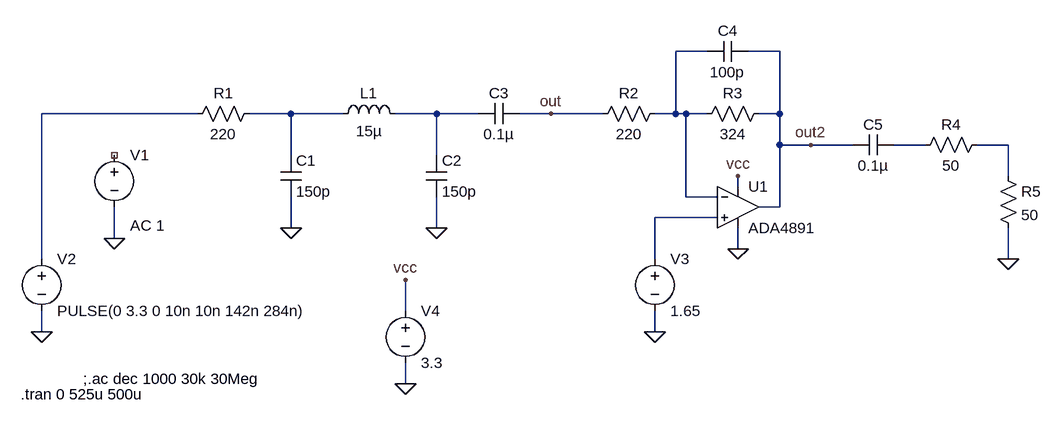
[diagram p0: schematic Baseband_Filter.asc]
Baseband_Filter.asc, the LTspice schematic file:
Version 4
SHEET 1 1240 680
WIRE 720 48 672 48
WIRE 832 48 784 48
WIRE -64 144 -304 144
WIRE 80 144 16 144
WIRE 160 144 80 144
WIRE 304 144 240 144
WIRE 368 144 304 144
WIRE 480 144 432 144
WIRE 560 144 480 144
WIRE 672 144 672 48
WIRE 672 144 640 144
WIRE 688 144 672 144
WIRE 720 144 688 144
WIRE 832 144 832 48
WIRE 832 144 800 144
WIRE 832 192 832 144
WIRE 880 192 832 192
WIRE 944 192 880 192
WIRE 1056 192 1008 192
WIRE 1184 192 1136 192
WIRE 80 208 80 144
WIRE 304 208 304 144
WIRE 1184 240 1184 192
WIRE 768 256 768 240
WIRE 688 272 688 144
WIRE 736 272 688 272
WIRE 832 288 832 192
WIRE 832 288 800 288
WIRE 736 304 640 304
WIRE 80 320 80 272
WIRE 304 320 304 272
WIRE -192 336 -192 288
WIRE 768 352 768 320
WIRE -304 368 -304 144
WIRE 640 368 640 304
WIRE 1184 368 1184 320
WIRE 256 448 256 400
WIRE -304 480 -304 448
WIRE 640 480 640 448
WIRE 256 560 256 528
FLAG 304 320 0
FLAG 80 320 0
FLAG -192 336 0
FLAG 480 144 out
FLAG -304 480 0
FLAG 768 240 vcc
FLAG 768 352 0
FLAG 640 480 0
FLAG 880 192 out2
FLAG 256 560 0
FLAG 256 400 vcc
FLAG 1184 368 0
SYMBOL ind 144 160 R270
WINDOW 0 32 56 VTop 2
WINDOW 3 5 56 VBottom 2
SYMATTR InstName L1
SYMATTR Value 15µ
SYMATTR SpiceLine Rser=1.2
SYMBOL cap 64 208 R0
SYMATTR InstName C1
SYMATTR Value 150p
SYMBOL cap 288 208 R0
SYMATTR InstName C2
SYMATTR Value 150p
SYMBOL res 32 128 R90
WINDOW 0 0 56 VBottom 2
WINDOW 3 32 56 VTop 2
SYMATTR InstName R1
SYMATTR Value 220
SYMBOL voltage -192 192 R0
WINDOW 123 24 124 Left 2
WINDOW 39 0 0 Left 0
SYMATTR Value2 AC 1
SYMATTR InstName V1
SYMATTR Value ""
SYMBOL cap 432 128 R90
WINDOW 0 0 32 VBottom 2
WINDOW 3 32 32 VTop 2
SYMATTR InstName C3
SYMATTR Value 0.1µ
SYMBOL res 656 128 R90
WINDOW 0 0 56 VBottom 2
WINDOW 3 32 56 VTop 2
SYMATTR InstName R2
SYMATTR Value 220
SYMBOL voltage -304 352 R0
WINDOW 123 0 0 Left 0
WINDOW 39 0 0 Left 0
SYMATTR InstName V2
SYMATTR Value PULSE(0 3.3 0 10n 10n 142n 284n)
SYMBOL OpAmps\\ADA4891 768 224 R0
SYMATTR InstName U1
SYMBOL voltage 640 352 R0
WINDOW 123 0 0 Left 0
WINDOW 39 0 0 Left 0
SYMATTR InstName V3
SYMATTR Value 1.65
SYMBOL res 816 128 R90
WINDOW 0 0 56 VBottom 2
WINDOW 3 32 56 VTop 2
SYMATTR InstName R3
SYMATTR Value 324
SYMBOL voltage 256 432 R0
WINDOW 123 0 0 Left 0
WINDOW 39 0 0 Left 0
SYMATTR InstName V4
SYMATTR Value 3.3
SYMBOL cap 784 32 R90
WINDOW 0 0 32 VBottom 2
WINDOW 3 32 32 VTop 2
SYMATTR InstName C4
SYMATTR Value 100p
SYMBOL res 1040 208 R270
WINDOW 0 32 56 VTop 2
WINDOW 3 0 56 VBottom 2
SYMATTR InstName R4
SYMATTR Value 50
SYMBOL cap 1008 176 R90
WINDOW 0 0 32 VBottom 2
WINDOW 3 32 32 VTop 2
SYMATTR InstName C5
SYMATTR Value 0.1µ
SYMBOL res 1168 224 R0
SYMATTR InstName R5
SYMATTR Value 50
TEXT -240 552 Left 2 !;.ac dec 1000 30k 30Meg
TEXT -336 576 Left 2 !.tran 0 525u 500u

The netlist it stands for:
* Baseband_Filter.asc
L1 N003 N004 15µ Rser=1.2
C1 N003 0 150p
C2 N004 0 150p
R1 N003 N002 220
V1 NC_01 0 AC 1
C3 out N004 0.1µ
R2 N001 out 220
V2 N002 0 PULSE(0 3.3 0 10n 10n 142n 284n)
XU1 N007 N001 vcc 0 out2 ADA4891-1  ; pins In+ In- V+ V- OUT
V3 N007 0 1.65
R3 out2 N001 324
V4 vcc 0 3.3
C4 out2 N001 100p
R4 N005 N006 50
C5 N005 out2 0.1µ
R5 N006 0 50
;.ac dec 1000 30k 30Meg
.tran 0 525u 500u
.lib ADA4891-1.lib
.backanno
.end